# Altium project LED Driver and Switch Breakout.PrjPcb
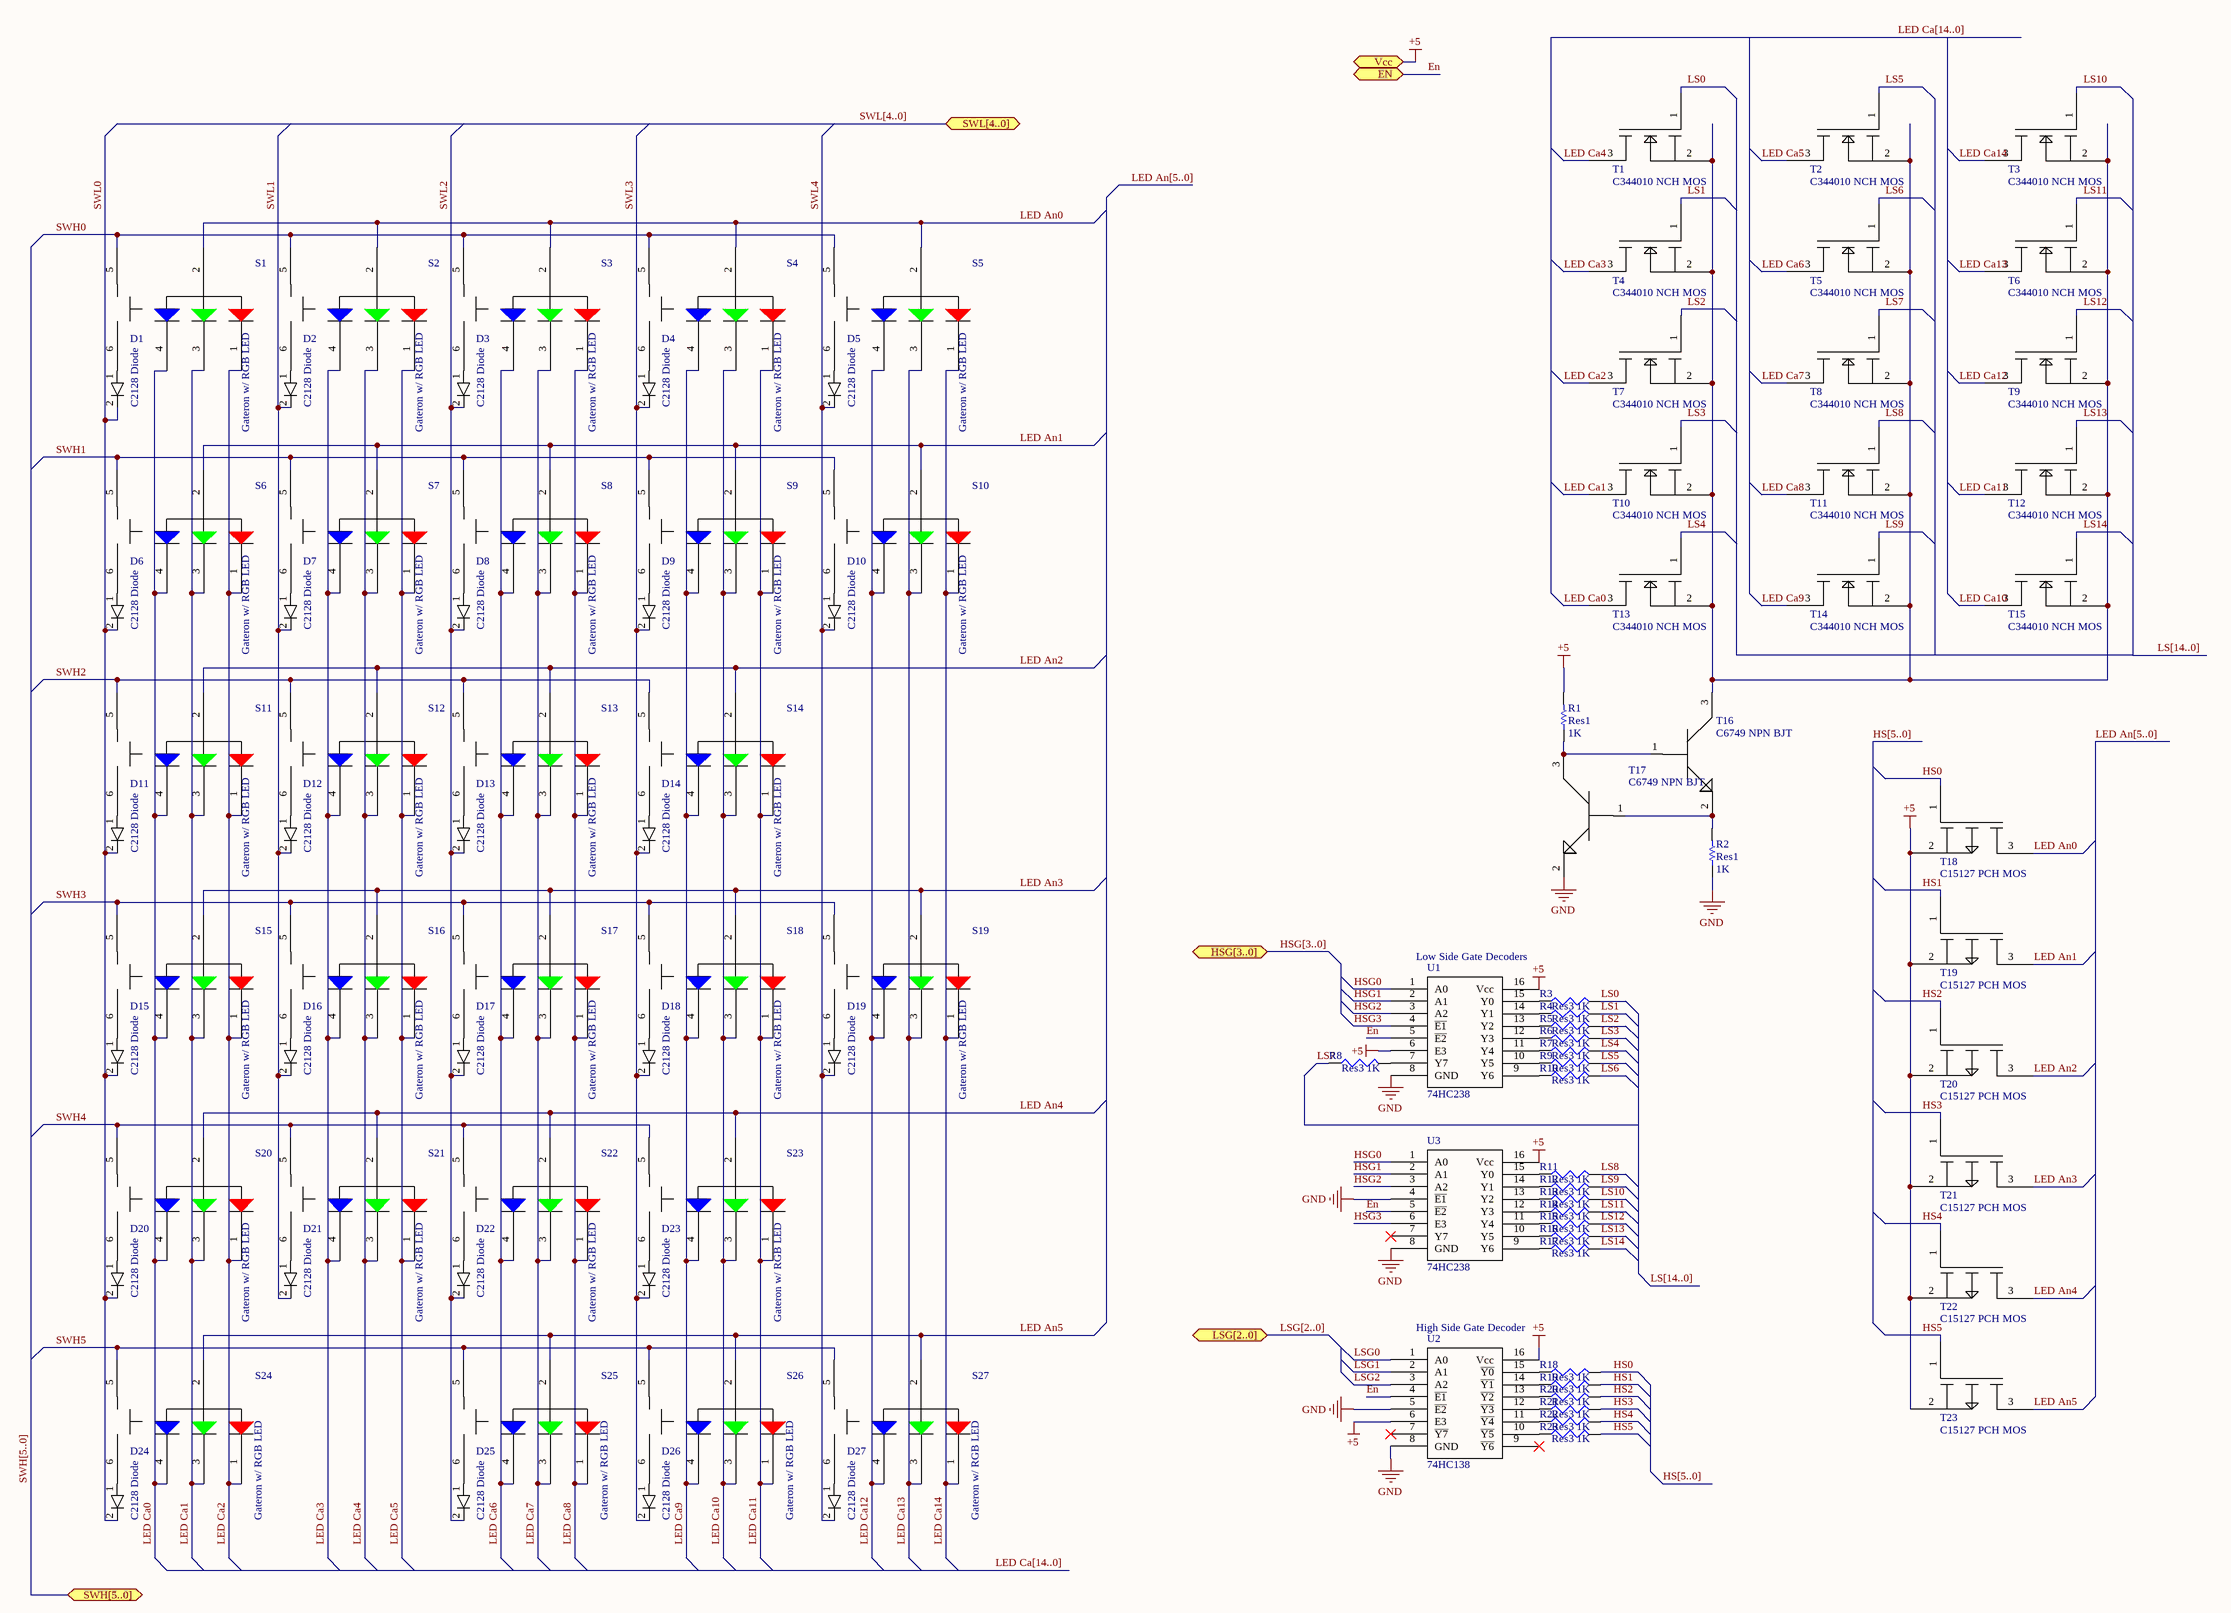
[diagram p0: LED Driver and Switches.SchDoc]
1 sheet, 103 parts. Net scope: flat (ports and power ports of the same name join across sheets).
Board file: LED Driver and Switch Breakout.PcbDoc

## Sheet LED Driver and Switches.SchDoc
size C; SheetNumber: 2; SheetTotal: 2

### Parts
D1  C2128 Diode  [C2128 SOD323]
D2  C2128 Diode  [C2128 SOD323]
D3  C2128 Diode  [C2128 SOD323]
D4  C2128 Diode  [C2128 SOD323]
D5  C2128 Diode  [C2128 SOD323]
D6  C2128 Diode  [C2128 SOD323]
D7  C2128 Diode  [C2128 SOD323]
D8  C2128 Diode  [C2128 SOD323]
D9  C2128 Diode  [C2128 SOD323]
D10  C2128 Diode  [C2128 SOD323]
D11  C2128 Diode  [C2128 SOD323]
D12  C2128 Diode  [C2128 SOD323]
D13  C2128 Diode  [C2128 SOD323]
D14  C2128 Diode  [C2128 SOD323]
D15  C2128 Diode  [C2128 SOD323]
D16  C2128 Diode  [C2128 SOD323]
D17  C2128 Diode  [C2128 SOD323]
D18  C2128 Diode  [C2128 SOD323]
D19  C2128 Diode  [C2128 SOD323]
D20  C2128 Diode  [C2128 SOD323]
D21  C2128 Diode  [C2128 SOD323]
D22  C2128 Diode  [C2128 SOD323]
D23  C2128 Diode  [C2128 SOD323]
D24  C2128 Diode  [C2128 SOD323]
D25  C2128 Diode  [C2128 SOD323]
D26  C2128 Diode  [C2128 SOD323]
D27  C2128 Diode  [C2128 SOD323]
R1  Res1  value 1K  [AXIAL-0.3]
R2  Res1  value 1K  [AXIAL-0.3]
R3  Res3  value 1K  [J1-0603]
R4  Res3  value 1K  [J1-0603]
R5  Res3  value 1K  [J1-0603]
R6  Res3  value 1K  [J1-0603]
R7  Res3  value 1K  [J1-0603]
R8  Res3  value 1K  [J1-0603]
R9  Res3  value 1K  [J1-0603]
R10  Res3  value 1K  [J1-0603]
R11  Res3  value 1K  [J1-0603]
R12  Res3  value 1K  [J1-0603]
R13  Res3  value 1K  [J1-0603]
R14  Res3  value 1K  [J1-0603]
R15  Res3  value 1K  [J1-0603]
R16  Res3  value 1K  [J1-0603]
R17  Res3  value 1K  [J1-0603]
R18  Res3  value 1K  [J1-0603]
R19  Res3  value 1K  [J1-0603]
R20  Res3  value 1K  [J1-0603]
R21  Res3  value 1K  [J1-0603]
R22  Res3  value 1K  [J1-0603]
R23  Res3  value 1K  [J1-0603]
S1  Gateron w/ RGB LED  [Gateron Green]
S2  Gateron w/ RGB LED  [Gateron Green]
S3  Gateron w/ RGB LED  [Gateron Green]
S4  Gateron w/ RGB LED  [Gateron Green]
S5  Gateron w/ RGB LED  [Gateron Green]
S6  Gateron w/ RGB LED  [Gateron Green]
S7  Gateron w/ RGB LED  [Gateron Green]
S8  Gateron w/ RGB LED  [Gateron Green]
S9  Gateron w/ RGB LED  [Gateron Green]
S10  Gateron w/ RGB LED  [Gateron Green]
S11  Gateron w/ RGB LED  [Gateron Green]
S12  Gateron w/ RGB LED  [Gateron Green]
S13  Gateron w/ RGB LED  [Gateron Green]
S14  Gateron w/ RGB LED  [Gateron Green]
S15  Gateron w/ RGB LED  [Gateron Green]
S16  Gateron w/ RGB LED  [Gateron Green]
S17  Gateron w/ RGB LED  [Gateron Green]
S18  Gateron w/ RGB LED  [Gateron Green]
S19  Gateron w/ RGB LED  [Gateron Green]
S20  Gateron w/ RGB LED  [Gateron Green]
S21  Gateron w/ RGB LED  [Gateron Green]
S22  Gateron w/ RGB LED  [Gateron Green]
S23  Gateron w/ RGB LED  [Gateron Green]
S24  Gateron w/ RGB LED  [Gateron Green]
S25  Gateron w/ RGB LED  [Gateron Green]
S26  Gateron w/ RGB LED  [Gateron Green]
S27  Gateron w/ RGB LED  [Gateron Green]
T1  C344010 NCH MOS  [C6749 NPN BJT]
T2  C344010 NCH MOS  [C6749 NPN BJT]
T3  C344010 NCH MOS  [C6749 NPN BJT]
T4  C344010 NCH MOS  [C6749 NPN BJT]
T5  C344010 NCH MOS  [C6749 NPN BJT]
T6  C344010 NCH MOS  [C6749 NPN BJT]
T7  C344010 NCH MOS  [C6749 NPN BJT]
T8  C344010 NCH MOS  [C6749 NPN BJT]
T9  C344010 NCH MOS  [C6749 NPN BJT]
T10  C344010 NCH MOS  [C6749 NPN BJT]
T11  C344010 NCH MOS  [C6749 NPN BJT]
T12  C344010 NCH MOS  [C6749 NPN BJT]
T13  C344010 NCH MOS  [C6749 NPN BJT]
T14  C344010 NCH MOS  [C6749 NPN BJT]
T15  C344010 NCH MOS  [C6749 NPN BJT]
T16  C6749 NPN BJT  [C6749 NPN BJT]
T17  C6749 NPN BJT  [C6749 NPN BJT]
T18  C15127 PCH MOS  [C6749 NPN BJT]
T19  C15127 PCH MOS  [C6749 NPN BJT]
T20  C15127 PCH MOS  [C6749 NPN BJT]
T21  C15127 PCH MOS  [C6749 NPN BJT]
T22  C15127 PCH MOS  [C6749 NPN BJT]
T23  C15127 PCH MOS  [C6749 NPN BJT]
U1  74HC238  [SOIC16]
U2  74HC138  [SOIC16]
U3  74HC238  [SOIC16]

### Ports
EN (bidir), HSG[3..0] (bidir), LSG[2..0] (bidir), SWH[5..0] (bidir), SWL[4..0] (bidir), Vcc (bidir)

### Nets
+5: R1.2 T18.2 T19.2 T20.2 T21.2 T22.2 T23.2 U1.6(E3) U1.16(Vcc) U2.6(E3) U2.16(Vcc) U3.16(Vcc) ; port Vcc
GND: R2.1 T17.2 U1.8(GND) U2.5(~{E2}) U2.8(GND) U3.4(~{E1}) U3.8(GND)
En: U1.5(~{E2}) U2.4(~{E1}) U3.5(~{E2}) ; port EN
HS0: R18.2 T18.1
HS1: R19.2 T19.1
HS2: R20.2 T20.1
HS3: R21.2 T21.1
HS4: R22.2 T22.1
HS5: R23.2 T23.1
HSG0: U1.1(A0) U3.1(A0)
HSG1: U1.2(A1) U3.2(A1)
HSG2: U1.3(A2) U3.3(A2)
HSG3: U1.4(~{E1}) U3.6(E3)
LED An0: S1.2(COM) S2.2(COM) S3.2(COM) S4.2(COM) S5.2(COM) T18.3
LED An1: S6.2(COM) S7.2(COM) S8.2(COM) S9.2(COM) S10.2(COM) T19.3
LED An2: S11.2(COM) S12.2(COM) S13.2(COM) S14.2(COM) T20.3
LED An3: S15.2(COM) S16.2(COM) S17.2(COM) S18.2(COM) S19.2(COM) T21.3
LED An4: S20.2(COM) S21.2(COM) S22.2(COM) S23.2(COM) T22.3
LED An5: S24.2(COM) S25.2(COM) S26.2(COM) S27.2(COM) T23.3
LED Ca0: S1.4(B) S6.4(B) S11.4(B) S15.4(B) S20.4(B) S24.4(B) T13.3
LED Ca1: S1.3(G) S6.3(G) S11.3(G) S15.3(G) S20.3(G) S24.3(G) T10.3
LED Ca2: S1.1(R) S6.1(R) S11.1(R) S15.1(R) S20.1(R) S24.1(R) T7.3
LED Ca3: S2.4(B) S7.4(B) S12.4(B) S16.4(B) S21.4(B) T4.3
LED Ca4: S2.3(G) S7.3(G) S12.3(G) S16.3(G) S21.3(G) T1.3
LED Ca5: S2.1(R) S7.1(R) S12.1(R) S16.1(R) S21.1(R) T2.3
LED Ca6: S3.4(B) S8.4(B) S13.4(B) S17.4(B) S22.4(B) S25.4(B) T5.3
LED Ca7: S3.3(G) S8.3(G) S13.3(G) S17.3(G) S22.3(G) S25.3(G) T8.3
LED Ca8: S3.1(R) S8.1(R) S13.1(R) S17.1(R) S22.1(R) S25.1(R) T11.3
LED Ca9: S4.4(B) S9.4(B) S14.4(B) S18.4(B) S23.4(B) S26.4(B) T14.3
LED Ca10: S4.3(G) S9.3(G) S14.3(G) S18.3(G) S23.3(G) S26.3(G) T15.3
LED Ca11: S4.1(R) S9.1(R) S14.1(R) S18.1(R) S23.1(R) S26.1(R) T12.3
LED Ca12: S5.4(B) S10.4(B) S19.4(B) S27.4(B) T9.3
LED Ca13: S5.3(G) S10.3(G) S19.3(G) S27.3(G) T6.3
LED Ca14: S5.1(R) S10.1(R) S19.1(R) S27.1(R) T3.3
LS0: R3.2 T1.1
LS1: R4.2 T4.1
LS2: R5.2 T7.1
LS3: R6.2 T10.1
LS4: R7.2 T13.1
LS5: R9.2 T2.1
LS6: R10.2 T5.1
LS7: R8.1 T8.1
LS8: R11.2 T11.1
LS9: R12.2 T14.1
LS10: R13.2 T3.1
LS11: R14.2 T6.1
LS12: R15.2 T9.1
LS13: R16.2 T12.1
LS14: R17.2 T15.1
LSG0: U2.1(A0)
LSG1: U2.2(A1)
LSG2: U2.3(A2)
SWH0: S1.5 S2.5 S3.5 S4.5 S5.5
SWH1: S6.5 S7.5 S8.5 S9.5 S10.5
SWH2: S11.5 S12.5 S13.5 S14.5
SWH3: S15.5 S16.5 S17.5 S18.5 S19.5
SWH4: S20.5 S21.5 S22.5 S23.5
SWH5: S24.5 S25.5 S26.5 S27.5
SWL0: D1.2 D6.2 D11.2 D15.2 D20.2 D24.2
SWL1: D2.2 D7.2 D12.2 D16.2 D21.2
SWL2: D3.2 D8.2 D13.2 D17.2 D22.2 D25.2
SWL3: D4.2 D9.2 D14.2 D18.2 D23.2 D26.2
SWL4: D5.2 D10.2 D19.2 D27.2
NetD1_1: D1.1 S1.6
NetD2_1: D2.1 S2.6
NetD3_1: D3.1 S3.6
NetD4_1: D4.1 S4.6
NetD5_1: D5.1 S5.6
NetD6_1: D6.1 S6.6
NetD7_1: D7.1 S7.6
NetD8_1: D8.1 S8.6
NetD9_1: D9.1 S9.6
NetD10_1: D10.1 S10.6
NetD11_1: D11.1 S11.6
NetD12_1: D12.1 S12.6
NetD13_1: D13.1 S13.6
NetD14_1: D14.1 S14.6
NetD15_1: D15.1 S15.6
NetD16_1: D16.1 S16.6
NetD17_1: D17.1 S17.6
NetD18_1: D18.1 S18.6
NetD19_1: D19.1 S19.6
NetD20_1: D20.1 S20.6
NetD21_1: D21.1 S21.6
NetD22_1: D22.1 S22.6
NetD23_1: D23.1 S23.6
NetD24_1: D24.1 S24.6
NetD25_1: D25.1 S25.6
NetD26_1: D26.1 S26.6
NetD27_1: D27.1 S27.6
NetR1_1: R1.1 T16.1 T17.3
NetR2_2: R2.2 T16.2 T17.1
NetR3_1: R3.1 U1.15(Y0)
NetR4_1: R4.1 U1.14(Y1)
NetR5_1: R5.1 U1.13(Y2)
NetR6_1: R6.1 U1.12(Y3)
NetR7_1: R7.1 U1.11(Y4)
NetR8_2: R8.2 U1.7(Y7)
NetR9_1: R9.1 U1.10(Y5)
NetR10_1: R10.1 U1.9(Y6)
NetR11_1: R11.1 U3.15(Y0)
NetR12_1: R12.1 U3.14(Y1)
NetR13_1: R13.1 U3.13(Y2)
NetR14_1: R14.1 U3.12(Y3)
NetR15_1: R15.1 U3.11(Y4)
NetR16_1: R16.1 U3.10(Y5)
NetR17_1: R17.1 U3.9(Y6)
NetR18_1: R18.1 U2.15(~{Y0})
NetR19_1: R19.1 U2.14(~{Y1})
NetR20_1: R20.1 U2.13(~{Y2})
NetR21_1: R21.1 U2.12(~{Y3})
NetR22_1: R22.1 U2.11(~{Y4})
NetR23_1: R23.1 U2.10(~{Y5})
NetT1_2: T1.2 T2.2 T3.2 T4.2 T5.2 T6.2 T7.2 T8.2 T9.2 T10.2 T11.2 T12.2 T13.2 T14.2 T15.2 T16.3

Not connected (* = marked no-connect by the designer): U2 7(~{Y7})* 9(~{Y6})*; U3 7(Y7)*

### Buses and harness runs
bus HS[5..0]
bus HSG[3..0] = port HSG[3..0]
bus LED An[5..0]
bus LED Ca[14..0]
bus LS[14..0]
bus LSG[2..0] = port LSG[2..0]
bus SWH[5..0] = port SWH[5..0]
bus SWL[4..0] = port SWL[4..0]

### Notes on the sheet
- Low Side Gate Decoders
- High Side Gate Decoder

### Library data of the parts
R1 R2 = Res1: Resistor; Published: 8-Jun-2000; LatestRevisionDate: 17-Jul-2002; LatestRevisionNote: Re-released for DXP Platform.; PackageReference: AXIAL-0.3; Publisher: Altium Limited; PackageDescription: Axial Device, Thru-Hole; 2 Leads; 0.3 in Pin Spacing
R3-R23 = Res3: Resistor; Published: 8-Jun-2000; LatestRevisionDate: 29-May-2009; LatestRevisionNote: IPC-7351 Footprint Added.; PackageReference: J1-0603; Publisher: Altium Limited; PackageDescription: Chip Resistor
S1-S27 = Gateron Green